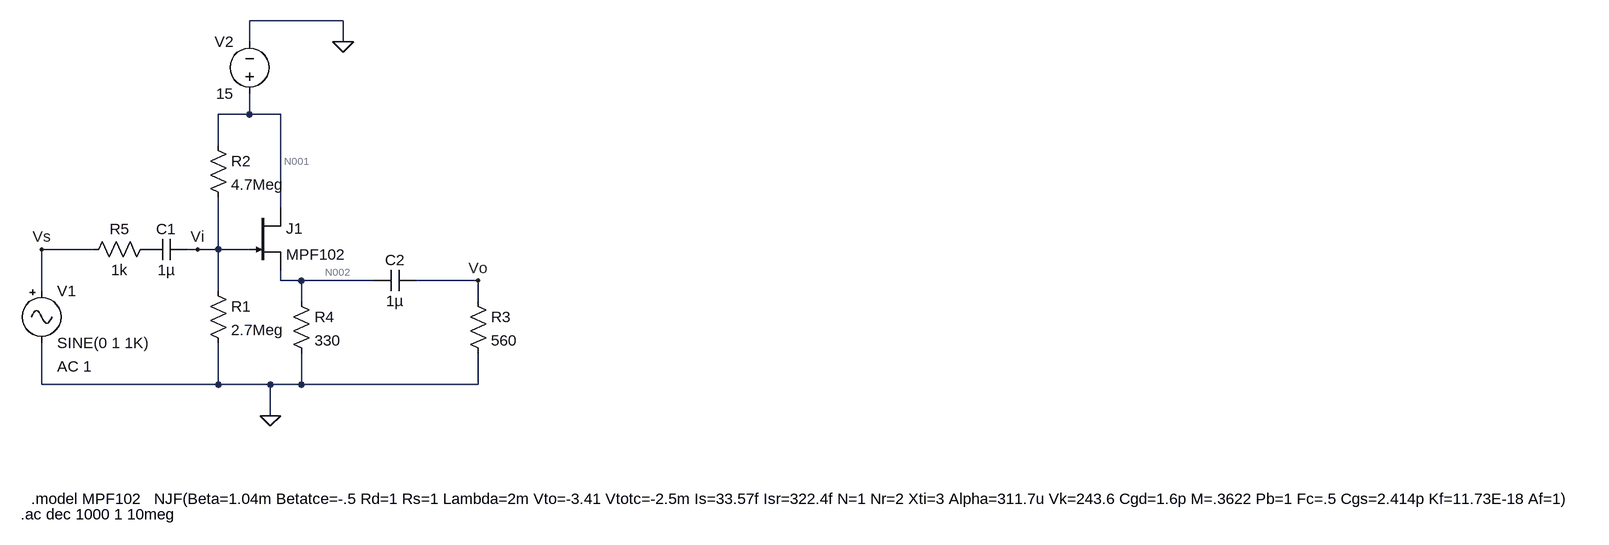
[diagram p0: schematic Simulacion.asc]
Simulacion.asc, the LTspice schematic file:
Version 4
SHEET 1 2212 680
WIRE 272 -256 128 -256
WIRE 128 -224 128 -256
WIRE 272 -224 272 -256
WIRE 128 -112 128 -144
WIRE 128 -112 80 -112
WIRE 176 -112 128 -112
WIRE 80 -64 80 -112
WIRE 176 32 176 -112
WIRE -112 96 -192 96
WIRE 48 96 32 96
WIRE 80 96 80 16
WIRE 80 96 48 96
WIRE 128 96 80 96
WIRE 176 144 176 128
WIRE 208 144 176 144
WIRE 320 144 208 144
WIRE 480 144 384 144
WIRE -192 160 -192 96
WIRE 80 160 80 96
WIRE 208 176 208 144
WIRE 480 176 480 144
WIRE -192 304 -192 240
WIRE 80 304 80 240
WIRE 80 304 -192 304
WIRE 160 304 80 304
WIRE 208 304 208 256
WIRE 208 304 160 304
WIRE 480 304 480 256
WIRE 480 304 208 304
WIRE 160 352 160 304
FLAG 160 352 0
FLAG 272 -224 0
FLAG 480 144 Vo
FLAG 48 96 Vi
FLAG -192 96 Vs
SYMBOL cap 32 80 R90
WINDOW 0 0 32 VBottom 2
WINDOW 3 32 32 VTop 2
SYMATTR InstName C1
SYMATTR Value 1µ
SYMBOL res 64 144 R0
SYMATTR InstName R1
SYMATTR Value 2.7Meg
SYMBOL res 64 -80 R0
SYMATTR InstName R2
SYMATTR Value 4.7Meg
SYMBOL res 464 160 R0
SYMATTR InstName R3
SYMATTR Value 560
SYMBOL cap 384 128 R90
WINDOW 0 0 32 VBottom 2
WINDOW 3 32 32 VTop 2
SYMATTR InstName C2
SYMATTR Value 1µ
SYMBOL njf 128 32 R0
SYMATTR InstName J1
SYMATTR Value MPF102
SYMBOL Misc\\signal -192 144 R0
WINDOW 123 24 132 Left 2
WINDOW 39 0 0 Left 2
SYMATTR Value2 AC 1
SYMATTR InstName V1
SYMBOL res 192 160 R0
SYMATTR InstName R4
SYMATTR Value 330
SYMBOL res -16 80 R90
WINDOW 0 0 56 VBottom 2
WINDOW 3 32 56 VTop 2
SYMATTR InstName R5
SYMATTR Value 1k
SYMBOL voltage 128 -128 R180
WINDOW 0 24 96 Left 2
WINDOW 3 24 16 Left 2
WINDOW 123 0 0 Left 2
WINDOW 39 0 0 Left 2
SYMATTR InstName V2
SYMATTR Value 15
TEXT -208 480 Left 2 !.model MPF102   NJF(Beta=1.04m Betatce=-.5 Rd=1 Rs=1 Lambda=2m Vto=-3.41 Vtotc=-2.5m Is=33.57f Isr=322.4f N=1 Nr=2 Xti=3 Alpha=311.7u Vk=243.6 Cgd=1.6p M=.3622 Pb=1 Fc=.5 Cgs=2.414p Kf=11.73E-18 Af=1)
TEXT -224 504 Left 2 !.ac dec 1000 1 10meg

The netlist it stands for:
* Simulacion.asc
C1 Vi P001 1µ
R1 Vi 0 2.7Meg
R2 N001 Vi 4.7Meg
R3 Vo 0 560
C2 Vo N002 1µ
J1 N001 Vi N002 MPF102
V1 Vs 0 SINE(0 1 1K) AC 1
R4 N002 0 330
R5 P001 Vs 1k
V2 N001 0 15
.model NJF NJF
.model PJF PJF
.lib standard.jft
.model MPF102   NJF(Beta=1.04m Betatce=-.5 Rd=1 Rs=1 Lambda=2m Vto=-3.41 Vtotc=-2.5m Is=33.57f Isr=322.4f N=1 Nr=2 Xti=3 Alpha=311.7u Vk=243.6 Cgd=1.6p M=.3622 Pb=1 Fc=.5 Cgs=2.414p Kf=11.73E-18 Af=1)
.ac dec 1000 1 10meg
.backanno
.end

* Results of the author's LTspice run, read from the files saved beside the schematic
* Operating Point, zero values left out:
*   V(vi) = 5.383 V
*   V(n001) = 15 V
*   V(n002) = 4.999 V
*   Id(J1) = 15.15 mA
*   Ig(J1) = 52.73 nA
*   Is(J1) = -15.15 mA
*   I(R4) = 15.15 mA
*   I(R2) = 2.046 µA
*   I(R1) = 1.994 µA
*   I(V2) = -15.15 mA
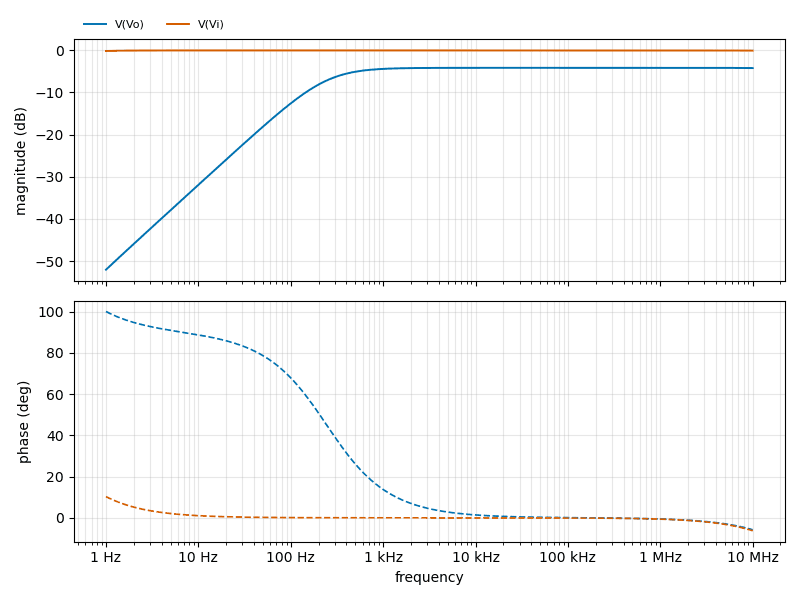
[diagram p1: AC Analysis of Simulacion.asc, plotted from the saved traces]
* AC Analysis, 1 run:
*   V(Vo): -52.05 dB at 1 Hz, -4.20 dB at 10 MHz, peak -4.14 dB at 144.5 kHz, 3 dB below the peak at 244.5 Hz
*   V(Vi): -0.15 dB at 1 Hz, -0.07 dB at 10 MHz, peak -0.01 dB at 63.1 Hz